# EAGLE schematic cableado (EAGLE 6.5.0)
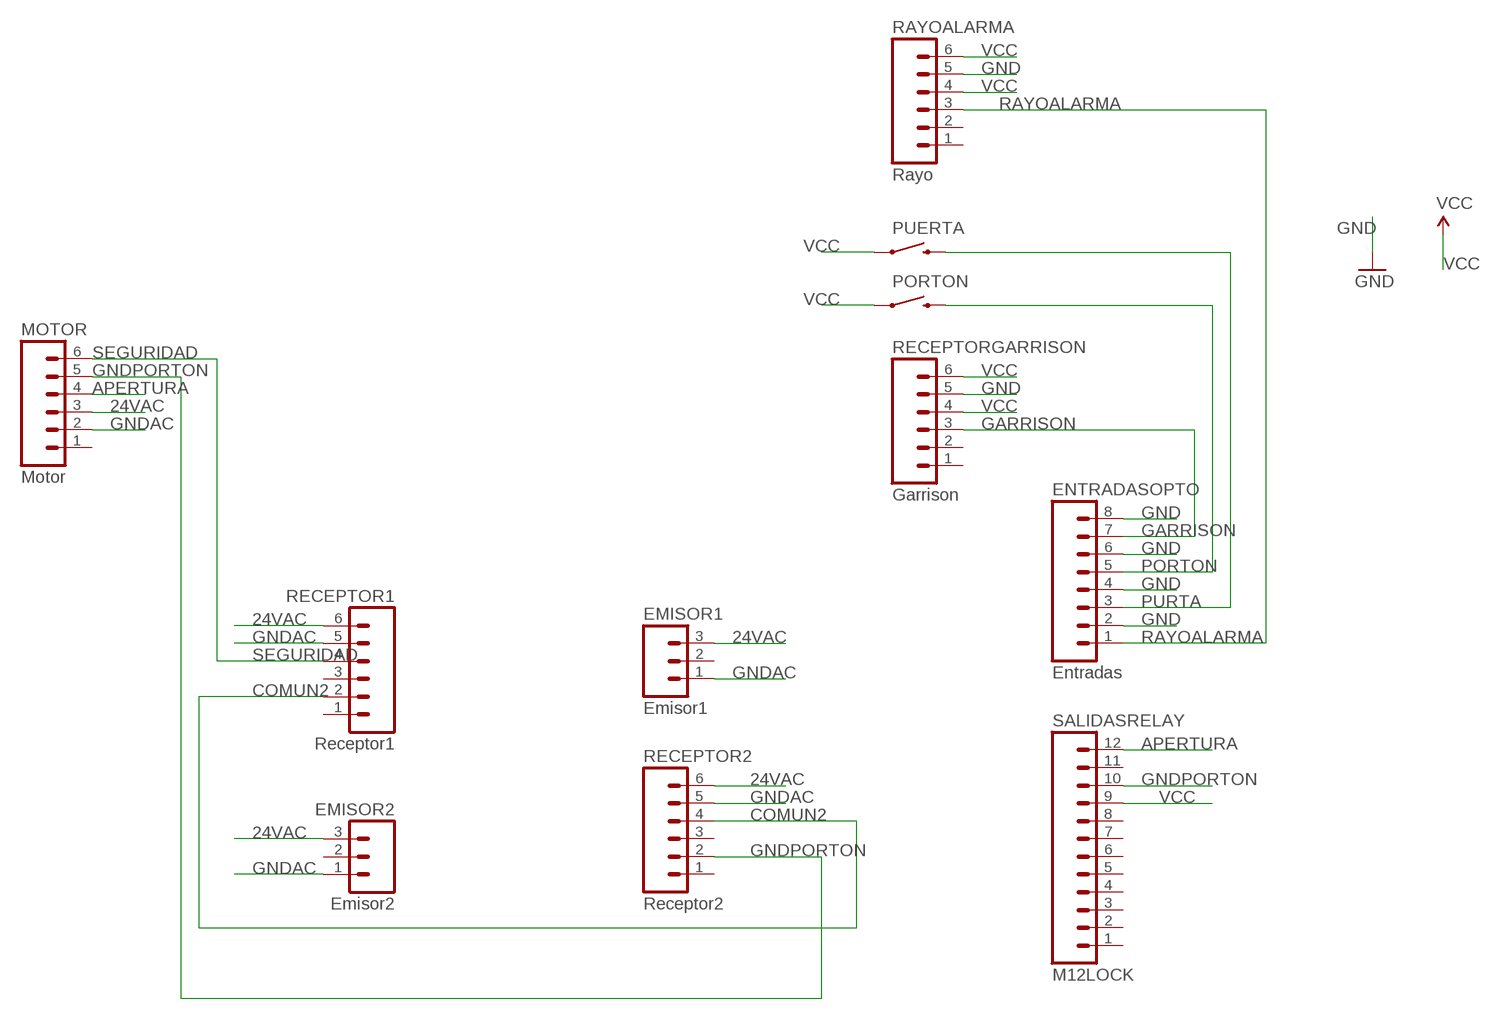
[diagram p0: schematic, sheet 1]

## Parts
EMISOR1  Emisor1  M03-SCREW-5MM  [SCREWTERMINAL-5MM-3]
EMISOR2  Emisor2  M03-SCREW-5MM  [SCREWTERMINAL-5MM-3]
ENTRADASOPTO  Entradas  M083.5MM-8  [SCREWTERMINAL-3.5MM-8]
MOTOR  Motor  M06POLAR  [MOLEX-1X6]
PORTON  SWITCH-MOMENTARY-2-SMD-1101NE  [TACTILE-SWITCH-1101NE]
PUERTA  SWITCH-MOMENTARY-2-SMD-1101NE  [TACTILE-SWITCH-1101NE]
RAYOALARMA  Rayo  M06POLAR  [MOLEX-1X6]
RECEPTOR1  Receptor1  M06POLAR  [MOLEX-1X6]
RECEPTOR2  Receptor2  M06POLAR  [MOLEX-1X6]
RECEPTORGARRISON  Garrison  M06POLAR  [MOLEX-1X6]
SALIDASRELAY  M12LOCK  [1X12_LOCK]

## Nets
24VAC: EMISOR1.3 EMISOR2.3 MOTOR.3 RECEPTOR1.6 RECEPTOR2.6
APERTURA: MOTOR.4 SALIDASRELAY.12
COMUN2: RECEPTOR1.2 RECEPTOR2.4
GARRISON: ENTRADASOPTO.7 RECEPTORGARRISON.3
GND: ENTRADASOPTO.2 ENTRADASOPTO.4 ENTRADASOPTO.6 ENTRADASOPTO.8 RAYOALARMA.5 RECEPTORGARRISON.5
GNDAC: EMISOR1.1 EMISOR2.1 MOTOR.2 RECEPTOR1.5 RECEPTOR2.5
GNDPORTON: MOTOR.5 RECEPTOR2.2 SALIDASRELAY.10
PORTON: ENTRADASOPTO.5 PORTON.2
PURTA: ENTRADASOPTO.3 PUERTA.2
RAYOALARMA: ENTRADASOPTO.1 RAYOALARMA.3
SEGURIDAD: MOTOR.6 RECEPTOR1.4
VCC: PORTON.1 PUERTA.1 RAYOALARMA.4 RAYOALARMA.6 RECEPTORGARRISON.4 RECEPTORGARRISON.6 SALIDASRELAY.9
Unconnected: EMISOR1.2 EMISOR2.2 MOTOR.1 RAYOALARMA.1 RAYOALARMA.2 RECEPTOR1.1 RECEPTOR1.3 RECEPTOR2.1 RECEPTOR2.3 RECEPTORGARRISON.1 RECEPTORGARRISON.2 SALIDASRELAY.1 SALIDASRELAY.2 SALIDASRELAY.3 SALIDASRELAY.4 SALIDASRELAY.5 SALIDASRELAY.6 SALIDASRELAY.7 SALIDASRELAY.8 SALIDASRELAY.11

## Library data of the parts
EMISOR1 EMISOR2 = SparkFun-Connectors:M03: Header 3 Standard 3-pin 0.1" header. Use with straight break away headers (SKU : PRT-00116), right angle break away headers (PRT-00553), swiss pins (PRT-00743), machine pins (PRT-00117), and female headers (PRT-00115). Molex polarized connector foot print use with SKU : PRT-08232 with associated crimp pins and housings.; STOREFRONT_ID: PRT-08433
ENTRADASOPTO = SparkFun-Connectors:M08: Header 8 Standard 8-pin 0.1" header. Use with straight break away headers (SKU : PRT-00116), right angle break away headers (PRT-00553), swiss pins (PRT-00743), machine pins (PRT-00117), and female headers (PRT-00115).
MOTOR RAYOALARMA RECEPTOR1 RECEPTOR2 RECEPTORGARRISON = SparkFun-Connectors:M06: Header 6 Standard 6-pin 0.1" header. Use with straight break away headers (SKU : PRT-00116), right angle break away headers (PRT-00553), swiss pins (PRT-00743), machine pins (PRT-00117), and female headers (PRT-00115). Molex polarized connector foot print use with SKU : PRT-08094 with associated crimp pins and housings. NOTES ON THE VARIANTS LOCK and LOCK_LONGPADS... This footprint was designed to help hold the alignment of a through-hole component (i.e. 6-pin header) while soldering it into place. You may notice that each hole has been shifted either up or down by 0.005 of an inch from it's more standard position (which is a perfectly straight line). This slight alteration caused the pins (the squares in the middle) to touch the edges of the holes. Because they are alternating, it causes a "brace" to hold the component in place. 0.005 has proven to be the perfect amount of "off-center" position when using our standard breakaway headers. Although looks a little odd when you look at the bare footprint, once you have a header in there, the alteration is very hard to notice. Also,if you push a header all the way into place, it is covered up entirely on the bottom side. This idea of altering the position of holes to aid alignment will be further integrated into the Sparkfun Library for other footprints. It can help hold any component with 3 or more connection pins.
PORTON PUERTA = SparkFun-Electromechanical:SWITCH-MOMENTARY-2: Various NO switches- pushbuttons, reed, etc
SALIDASRELAY = SparkFun-Connectors:M12: Header 12 Standard 12-pin 0.1" header. Use with straight break away headers (SKU : PRT-00116), right angle break away headers (PRT-00553), swiss pins (PRT-00743), machine pins (PRT-00117), and female headers (PRT-00115).